# Altium schematic sheet ShutdownLoop.SchDoc: QUTMS Shutdown V2 - ShutdownLoop
size A4; Organization: QUT Motorsport; Address1: O-120; Address2: O Block; Address3: QUT Gardnes Point; Address4: Brisbane, 4000; DocumentNumber: 2; SheetNumber: 2; SheetTotal: 10
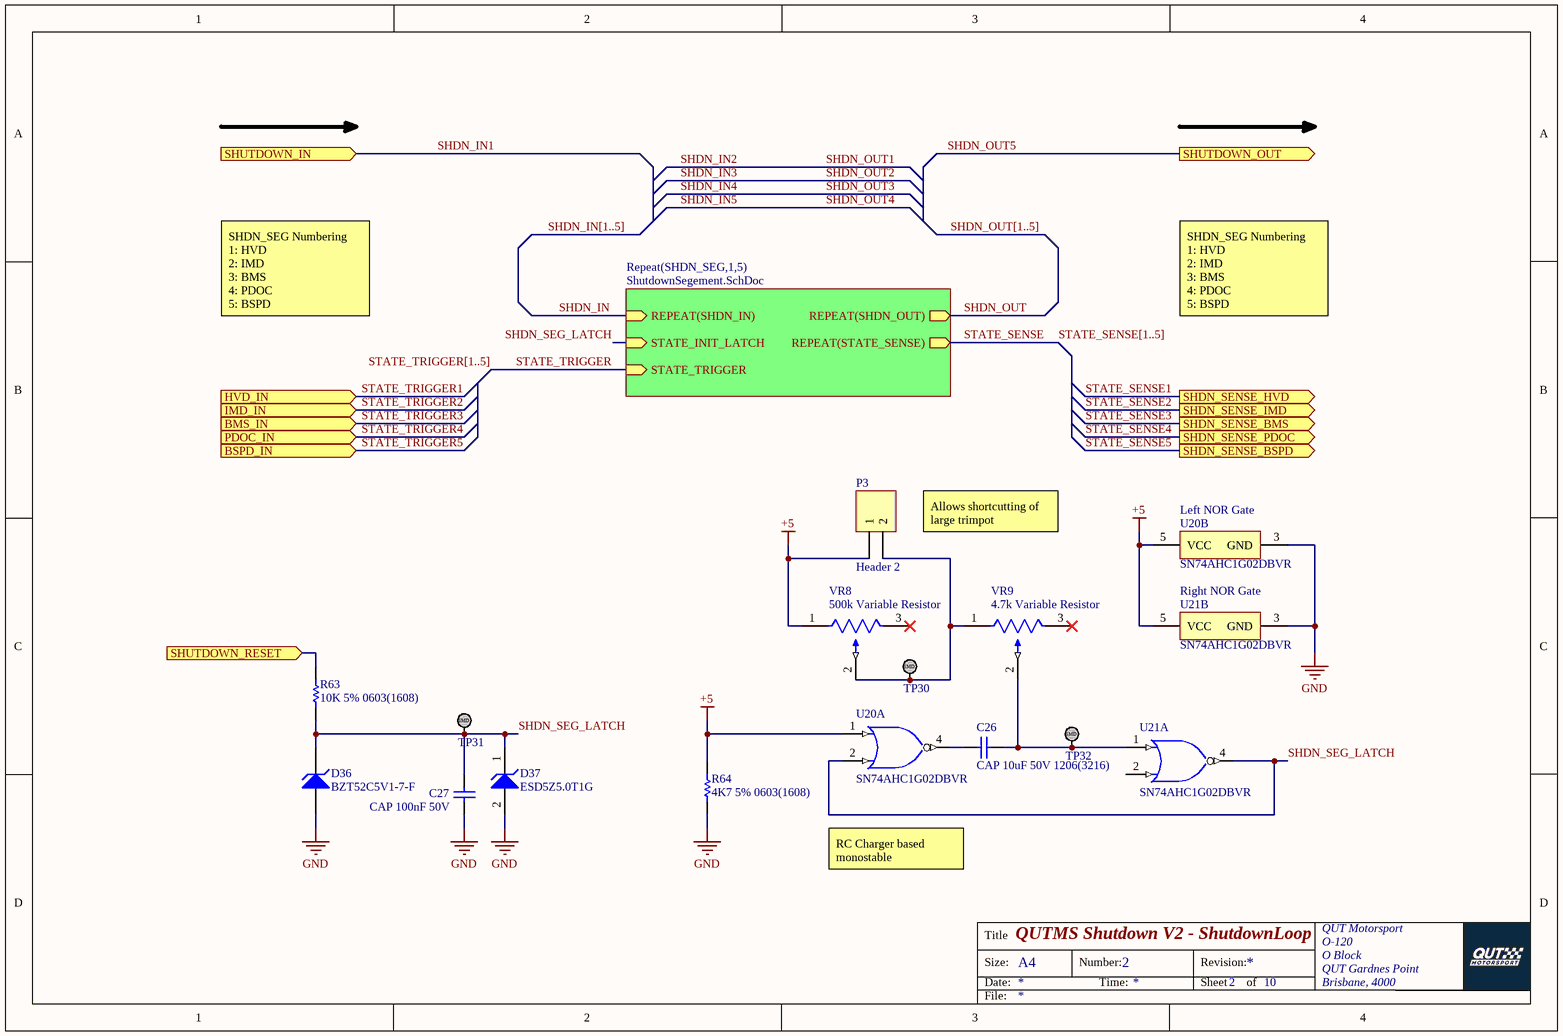
[diagram p0: ShutdownLoop.SchDoc]

## Parts
C26  CAP 10uF 50V 1206(3216)  [CAPC1206(3216)190_M]
C27  CAP 100nF 50V  [CAPC0603(1608)100_L]
D36  BZT52C5V1-7-F  [DIOD-SOD123_V]
D37  ESD5Z5.0T1G  [ONSC-SOD-523-2-502-01_V]
P3  Header 2  [HDR1X2]
R63  10K 5% 0603(1608)  [RESC0603(1608)_N]
R64  4K7 5% 0603(1608)  [RESC0603(1608)_N]
TP30  TestPoint_SMD  [TestPointSMD]  (value not drawn)
TP31  TestPoint_SMD  [TestPointSMD]  (value not drawn)
TP32  TestPoint_SMD  [TestPointSMD]  (value not drawn)
U20  SN74AHC1G02DBVR  [DBV0005A_L]  (parts A,B of 2)
U21  SN74AHC1G02DBVR  [DBV0005A_L]  (parts A,B of 2)
VR8  500k Variable Resistor  [VG039NCHXTB472]
VR9  4.7k Variable Resistor  [VG039NCHXTB472]

## Sub-sheets
Repeat(SHDN_SEG,1,5) = ShutdownSegement.SchDoc: REPEAT(SHDN_OUT) (out), REPEAT(SHDN_IN) (in), STATE_INIT_LATCH (in), STATE_TRIGGER (in), REPEAT(STATE_SENSE) (out)

## Ports
BMS_IN (in), BSPD_IN (in), HVD_IN (in), IMD_IN (in), PDOC_IN (in), SHDN_SENSE_BMS (out), SHDN_SENSE_BSPD (out), SHDN_SENSE_HVD (out), SHDN_SENSE_IMD (out), SHDN_SENSE_PDOC (out), SHUTDOWN_IN (in), SHUTDOWN_OUT (out), SHUTDOWN_RESET (in)

## Nets
+5: P3.1 R64.2 U20.1(A) U20.5(VCC) U21.5(VCC) VR8.1
GND: C27.2 D36.1(A) D37.2(A) R64.1 U20.3(GND) U21.3(GND)
SHDN_IN: sheet Repeat(SHDN_SEG,1,5)/REPEAT(SHDN_IN)
SHDN_IN1: port SHUTDOWN_IN
SHDN_OUT: sheet Repeat(SHDN_SEG,1,5)/REPEAT(SHDN_OUT)
SHDN_OUT5: port SHUTDOWN_OUT
SHDN_SEG_LATCH: C27.1 D36.2(K) D37.1(K) R63.2 TP31.1 U20.2(B) U21.4(Y) ; sheet Repeat(SHDN_SEG,1,5)/STATE_INIT_LATCH
SHUTDOWN_RESET: R63.1 ; port SHUTDOWN_RESET
STATE_SENSE: sheet Repeat(SHDN_SEG,1,5)/REPEAT(STATE_SENSE)
STATE_SENSE1: port SHDN_SENSE_HVD
STATE_SENSE2: port SHDN_SENSE_IMD
STATE_SENSE3: port SHDN_SENSE_BMS
STATE_SENSE4: port SHDN_SENSE_PDOC
STATE_SENSE5: port SHDN_SENSE_BSPD
STATE_TRIGGER: sheet Repeat(SHDN_SEG,1,5)/STATE_TRIGGER
STATE_TRIGGER1: port HVD_IN
STATE_TRIGGER2: port IMD_IN
STATE_TRIGGER3: port BMS_IN
STATE_TRIGGER4: port PDOC_IN
STATE_TRIGGER5: port BSPD_IN
NetC26_1: C26.1 TP32.1 U21.1(A) VR9.2
NetC26_2: C26.2 U20.4(Y)
NetP3_2: P3.2 TP30.1 VR8.2 VR9.1

Not connected (* = marked no-connect by the designer): U21 2(B); VR8 3(49)*; VR9 3(49)*

## Buses and harness runs
bus SHDN_IN[1..5]
bus SHDN_OUT[1..5]
bus STATE_SENSE[1..5]
bus STATE_TRIGGER[1..5]

## Notes on the sheet
- SHDN_SEG Numbering
  1: HVD
  2: IMD
  3: BMS
  4: PDOC
  5: BSPD
- (near U20) Left NOR Gate
- (near P3) Allows shortcutting of large trimpot
- Right NOR Gate
- RC Charger based monostable
- Title
- Size:
- Date:
- A4
- Number:
- Time:
- Revision:
- Sheet
- of
- File:
- (in symbol TestPoint_SMD) SMD

## Library data of the parts
C26 = CMP-1037-04982-1: CAP 10uF 50V ±10% 1206 (3216 Metric) Thickness 1.9mm SMD; Case-EIA: 1206; Tolerance: Â±10%; Case-Metric: 3216; Technology: SMT; Max Thickness: 1.9 mm; Value: 10uF; Rated Voltage: 50 V
C27 = CMP-1035-02591-1: CAP 100nF 50V ±5% 0603 (1608 Metric) Thickness 1mm SMD; Tolerance: Â±5%; Case-Metric: 1608; Case-EIA: 0603; Rated Voltage: 50 V; Max Thickness: 1 mm; Technology: SMT; Value: 100nF
D36 = CMP-2000-05976-1: Surface Mount Zener Diode, 5.1 V, -65 to 150 degC, 2-Pin SMD (SOD-123), RoHS, Tape and Reel; Manufacturer: DiodesIncorporated; Unit Weight: 0.000353oz; Zz - Zener Impedance: 60Ohms; Vz - Zener Voltage: 5.1V; Pd - Power Dissipation: 500mW; Zener Current: 5mA; Ir - Reverse Current: 2uA; Voltage Temperature Coefficient: -0.75mV/C; Configuration: Single; Voltage Tolerance: 6%; Height: 1.35mm; Width: 1.7mm; Minimum Operating Temperature: -65C; Series: BZT52C5; Package Description: 2-Pin Surface Mount Device, Body 2.7 x 1.55 mm; Length: 2.85mm; Mounting Technology: SurfaceMount; Brand: DiodesIncorporated; Factory Pack Quantity: 3000; Product Category: ZenerDiodes; RoHS: True; Manufacturer URL: http://www.diodes.com/; Termination Style: SMD/SMT; Package / Case: SOD-123; Packaging: Reel; Package Reference: SOD123; Datasheet Version: Rev. 37-2, 09/2012; Maximum Operating Temperature: +150C; Datasheet URL: http://www.diodes.com/_files/datasheets/ds18004.pdf; Mounting Style: SMD/SMT
D37 = CMP-1063-00102-1: Transient Voltage Suppressor, Micro-Packaged Diode for ESD Protection, 2-Pin SOD-523, Pb-Free, Tape and Reel; Manufacturer: On Semiconductor; V(BR) Min (V): 6.2; VRWM Max (V): 5; Number of Lines: 1; PPK Max (W): 174; IR Max (uA): 0.05; Direction: Unidirectional; PackageVersion: Rev. E, 09/2010; Mounting Technology: Surface Mount; Packing: Tape and Reel; ComponentLink2URL: http://www.onsemi.cn/pub_link/Collateral/ESD5Z2.5T1-D.PDF; ComponentLink2Description: Datasheet; PackageReference: SOD-523-2-502-01; ComponentLink1Description: Manufacturer URL; ComponentLink3URL: http://www.onsemi.com/pub_link/Collateral/502-01.PDF; PackageDescription: 2-Pin SOD, Body 1.2 x 0.8 mm; ComponentLink3Description: Package Specification; ComponentLink1URL: http://www.onsemi.com/; RoHS: Pb-Free; PartNumber: ESD5Z5.0T1G; DatasheetVersion: Rev. 10
P3 = Header 2: Header, 2-Pin; LatestRevisionDate: 17-Jul-2002; LatestRevisionNote: Re-released for DXP Platform.; Publisher: Altium Limited
R63 = CMP-1012-00098-1: 10K 0.1W 5% 0603 (1608 Metric)  SMD; Case-EIA: 0603; Value: 10000.00 Ohm; Case-Metric: 1608; Technology: SMT; Tolerance: 5 %; Power: 0.1 W
R64 = CMP-1012-00090-1: 4K7 0.1W 5% 0603 (1608 Metric)  SMD; Case-Metric: 1608; Value: 4700.00 Ohm; Case-EIA: 0603; Tolerance: 5 %; Technology: SMT; Power: 0.1 W
U20 U21 = CMP-0859-00024-3: Single 2-Input Positive-NOR Gate, DBV0005A, LARGE T&R; Manufacturer: Texas Instruments; Output Drive (IOL/IOH)(Max)(mA): 50/-50; Sub-Family: NAND Gate; Gate Type: NOR; Output Type: CMOS; 3-State Output: No; Voltage(Nom)(V): 3.3,5; tpd @ Nom Voltage(Max)(ns): 11.4,7.5; Bits(#): 1; VCC(Max)(V): 5.5; ICC @ Nom Voltage(Max)(mA): 0.01; VCC(Min)(V): 2; Technology Family: AHC; Rating: Catalog; Logic: True; F @ Nom Voltage(Max)(Mhz): 75; DatasheetVersion: SCLS342M; Input Type: CMOS; Operating Temperature Range(C): -40 to 125,-40 to 85; Generic Part Number: SN74AHC1G02; PackageReference: DBV0005A; Schmitt Trigger: No
VR8 = 500k Variable Resistor: 500K ±25% ±250 ppm/°C SMD Variable Resistors RoHS | VG039NCHXTB504; ComponentLink1Description: LCSC; ComponentLink1URL: https://lcsc.com/product-detail/Variable-Resistors_HDK-Hokuriku-Elec-Industry-VG039NCHXTB504_C128558.html
VR9 = 4.7k Variable Resistor: 4k7 ±25% ±250 ppm/°C SMD Variable Resistors RoHS | VG039NCHXTB472; ComponentLink1Description: LCSC; ComponentLink1URL: https://lcsc.com/product-detail/Variable-Resistors_HDK-Hokuriku-Elec-Industry-VG039NCHXTB472_C128555.html